# Altium schematic sheet payment.SchDoc
size A; SheetNumber: 1; SheetTotal: 1
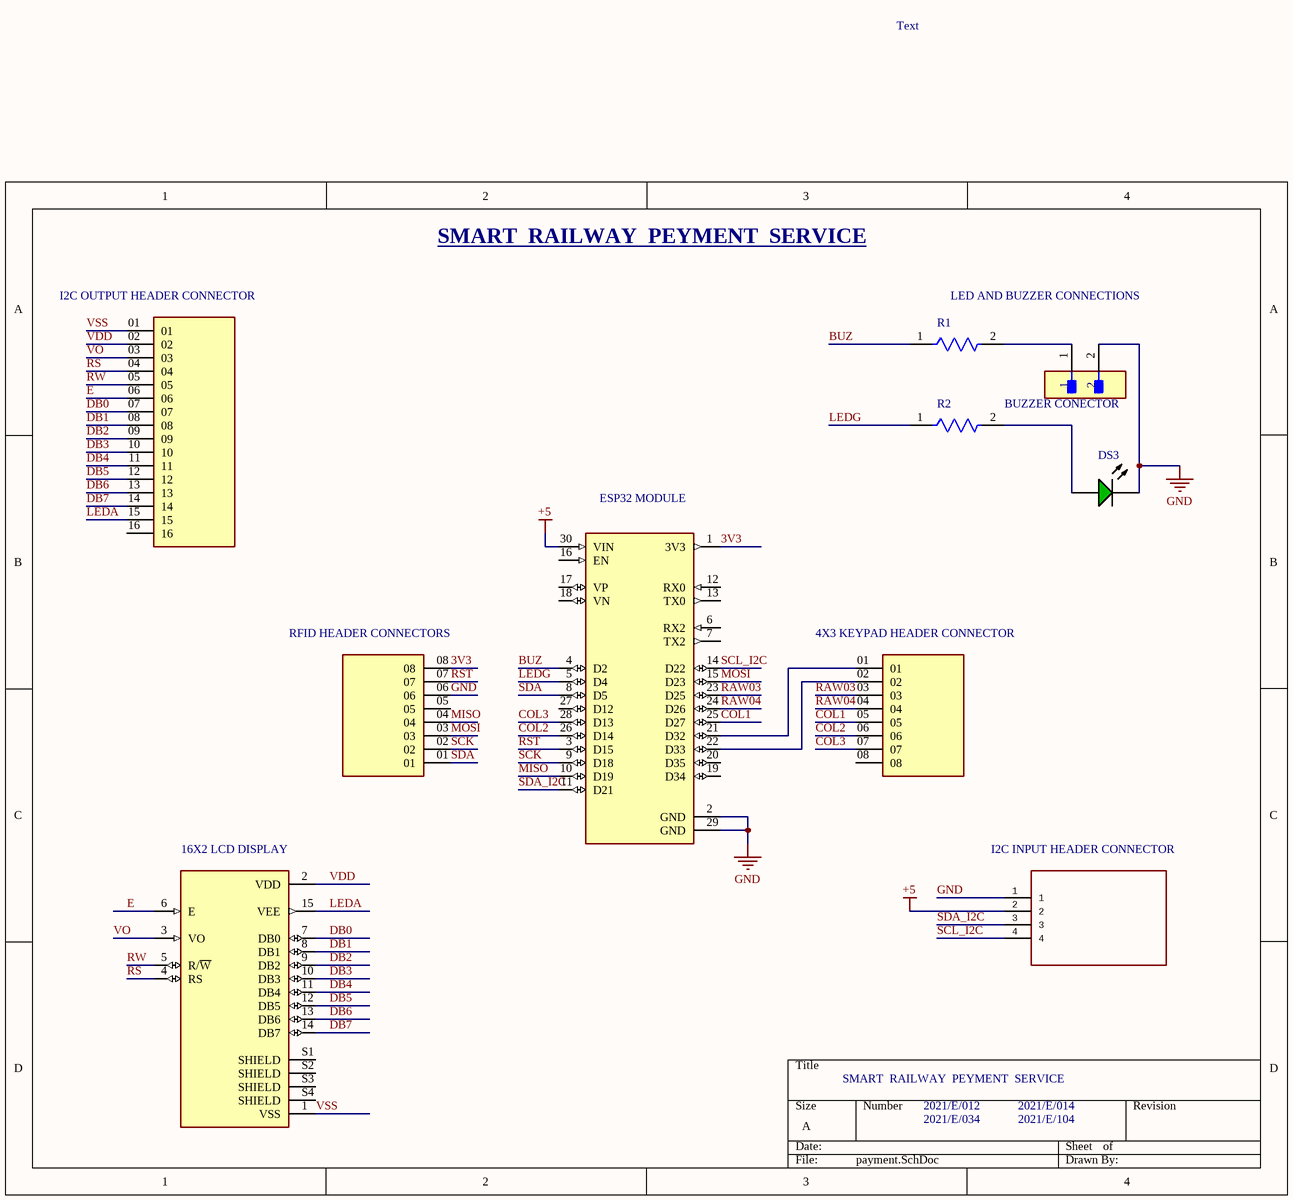
[diagram p0: payment.SchDoc]

## Parts
BUZZER_CONECTOR  M20-9990246  [FP-M20-9990246-MFG]  (value not drawn)
DS3  WP7113SGC  [KING-WP7113SGC_V]  (value not drawn)
DSI  RC1602B-BIW-CSV  [LCD_RC1602B-BIW-CSV]  (value not drawn)
I2C  TSW-116-13-G-S  [SAMTEC_TSW-116-13-G-S]  (value not drawn)
K-4X3  MTSW-108-08-T-S-285  [SAMTEC_MTSW-108-08-T-S-285]  (value not drawn)
R1  MRS25000C1001FCT00  [FP-MRS25-MFG]  (value not drawn)
R2  MRS25000C1001FCT00  [FP-MRS25-MFG]  (value not drawn)
RFID  MTSW-108-08-T-S-285  [SAMTEC_MTSW-108-08-T-S-285]  (value not drawn)
SERIAL  SAMTEC-HTSW-104-20-X-SJ  [SAMTEC-HTSW-104-20-X-S]  (value not drawn)
U1  ESP32-DEVKIT-V1  [MODULE_ESP32_DEVKIT_V1]  (value not drawn)

## Nets
+5: SERIAL.2 U1.30(VIN)
GND: BUZZER_CONECTOR.2 DS3.2(K) RFID.06 SERIAL.1 U1.2(GND) U1.29(GND)
3V3: RFID.08 U1.1(3V3)
BUZ: R1.1 U1.4(D2)
COL1: K-4X3.05 U1.25(D27)
COL2: K-4X3.06 U1.26(D14)
COL3: K-4X3.07 U1.28(D13)
DB0: DSI.7(DB0) I2C.07
DB1: DSI.8(DB1) I2C.08
DB2: DSI.9(DB2) I2C.09
DB3: DSI.10(DB3) I2C.10
DB4: DSI.11(DB4) I2C.11
DB5: DSI.12(DB5) I2C.12
DB6: DSI.13(DB6) I2C.13
DB7: DSI.14(DB7) I2C.14
E: DSI.6(E) I2C.06
LEDA: DSI.15(VEE) I2C.15
LEDG: R2.1 U1.5(D4)
MISO: RFID.04 U1.10(D19)
MOSI: RFID.03 U1.15(D23)
RAW03: K-4X3.03 U1.23(D25)
RAW04: K-4X3.04 U1.24(D26)
RS: DSI.4(RS) I2C.04
RST: RFID.07 U1.3(D15)
RW: DSI.5(R/~{W}) I2C.05
SCK: RFID.02 U1.9(D18)
SCL_I2C: SERIAL.4 U1.14(D22)
SDA: RFID.01 U1.8(D5)
SDA_I2C: SERIAL.3 U1.11(D21)
VDD: DSI.2(VDD) I2C.02
VO: DSI.3(VO) I2C.03
VSS: DSI.1(VSS) I2C.01
NetBUZZER_CONECTOR_1: BUZZER_CONECTOR.1 R1.2
NetDS3_1: DS3.1(A) R2.2
NetK-4X3_01: K-4X3.01 U1.21(D32)
NetK-4X3_02: K-4X3.02 U1.22(D33)

Not connected (* = marked no-connect by the designer): DSI S1(SHIELD) S2(SHIELD) S3(SHIELD) S4(SHIELD); I2C 16; K-4X3 08; RFID 05; U1 6(RX2) 7(TX2) 12(RX0) 13(TX0) 16(EN) 17(VP) 18(VN) 19(D34) 20(D35) 27(D12)

## Notes on the sheet
- Text
- SMART  RAILWAY  PEYMENT  SERVICE
- (near I2C) I2C OUTPUT HEADER CONNECTOR
- (near R1) LED AND BUZZER CONNECTIONS
- Type @ to refer to a designator or a net
- (near U1) ESP32 MODULE
- (near RFID) RFID HEADER CONNECTORS
- (near K-4X3) 4X3 KEYPAD HEADER CONNECTOR
- (near DSI) 16X2 LCD DISPLAY
- (near SERIAL) I2C INPUT HEADER CONNECTOR
- 2021/E/012
- 2021/E/034
- 2021/E/104
- 2021/E/014

## Library data of the parts
BUZZER_CONECTOR = CMP-15831-000009-1: CONN HEADER VERT 2POS 2.54MM; Manufacturer: Harwin; Conn Gender: Male; Description: Connector Header Through Hole 2 position 0.100" (2.54mm); Conn Orientation: Vertical; Number Of Contacts: 2; Current Rating: 3A; ComponentLink2URL: https://cdn.harwin.com/pdfs/M20-999.pdf; ComponentLink2Description: Datasheet; Package: M20-9990246; Temperature: -40°C to +105°C; Octopart: https://octopart.com/m20-9990246-harwin-2590635; Mouser Description: 2.54mm (0.1") Pitch SIL Vertical PC Tail Pin Header, 6.1mm mating pin height, tin, 2 contacts; Temperature Range High: +105°C; Device Class L1: Connectors; RoHS: TRUE; Automotive: No; Height: 8.99mm; Number Of Rows: 1; Contact Material: Tin,Nickel; Category: Conn; Pitch: 2.54mm; Lead Free: Yes; Digikey Description: CONN HEADER VERT 2POS 2.54MM; Manufacturer Part Number: M20-9990246; Temperature Range Low: -40°C; Device Class L3: unset; Device Class L2: Headers and Wire Housings
DS3 = CMP-007-00032-2: The Super Bright Green Source Color Device, 2.2 V, -40 to 85 degC, 2-Pin THD, RoHS, Tape and Reel; Manufacturer: Kingbright; Luminous Intensity: 200mcd; Nominal Vf: 2.2V; Viewing Angle: 20degrees; Lens Style: Clear; Mounting Technology: TH; Forward Voltage: 2.2V; Colour: Green; Package Quantity: 1000; Datasheet Version: Rev. 9B, 01/2015; RoHS Compliant: True; Case/Package: Radial; Package Description: 2-Pin Through Hole Device, Dia 5.9 mm, Body Length 8.6 mm; Packaging: Bulk; Illumination Colour: Green; Datasheet URL: http://www.kingbrightusa.com/images/catalog/SPEC/WP7113SGC.pdf; Package Reference: WP7113SGC
DSI = RC1602B-BIW-CSV: Display: LCD; alphanumeric; STN Negative; 16x2; blue; LED; PIN: 16; MF: Raystar; Value: *; SnapEDA_Link: https://www.snapeda.com/parts/RC1602B-BIW-CSV/Raystar/view-part/?ref=snap; Availability: Not in stock; Price: None; Package: None; Check_prices: https://www.snapeda.com/parts/RC1602B-BIW-CSV/Raystar/view-part/?ref=eda; MP: RC1602B-BIW-CSV
R1 R2 = CMP-02408-000051-1: RES 1K OHM 0.6W 1% AXIAL; Power Rating: 600mW; Lead Diameter: 0.6mm; Voltage Rating (DC): 350V; Resistance: 1kR; Temperature Coefficient: 50ppm/°C; Width: 2.5mm; Military Standard: Not; Package Quantity: 5000; Radiation Hardening: No; Case/Package: Axial; Resistance Tolerance: 1%; Resistor Type: Metal Film; Contact Plating: Tin; Length: 6.5mm; Lead Free: Lead Free; RoHS Compliant: Yes; Mount: Through Hole; Number of Pins: 2; Technology: THIN FILM; Voltage Rating: 350V; Min Operating Temperature: -55°C; Weight: 0.00776oz; Diameter: 2.5mm; Construction: Cylindrical; Series: MRS25; Tolerance: 1%; Packaging: Tape and Reel; Max Operating Temperature: 155°C; Max Power Dissipation: 600mW; Number of Terminations: 2; Termination: Axial
U1 = ESP32-DEVKIT-V1: Dual core, Wi-Fi: 2.4 GHz up to 150 Mbits/s,BLE (Bluetooth Low Energy) and legacy Bluetooth, 32 bits, Up to 240 MHz; MF: Do it; Price: None; Availability: Not in stock; Package: None; MP: ESP32-DEVKIT-V1; Value: *; SnapEDA_Link: https://www.snapeda.com/parts/ESP32-DEVKIT-V1/Do+it/view-part/?ref=snap; Check_prices: https://www.snapeda.com/parts/ESP32-DEVKIT-V1/Do+it/view-part/?ref=eda
I2C = TSW-116-13-G-S: Package: None; Price: None; Value: *; MP: TSW-116-13-G-S; Availability: Unavailable
K-4X3 RFID = MTSW-108-08-T-S-285: MP: MTSW-108-08-T-S-285; Package: None; Price: None; Value: *; Availability: Unavailable